# Altium schematic sheet [00] DACs.SchDoc
size A4
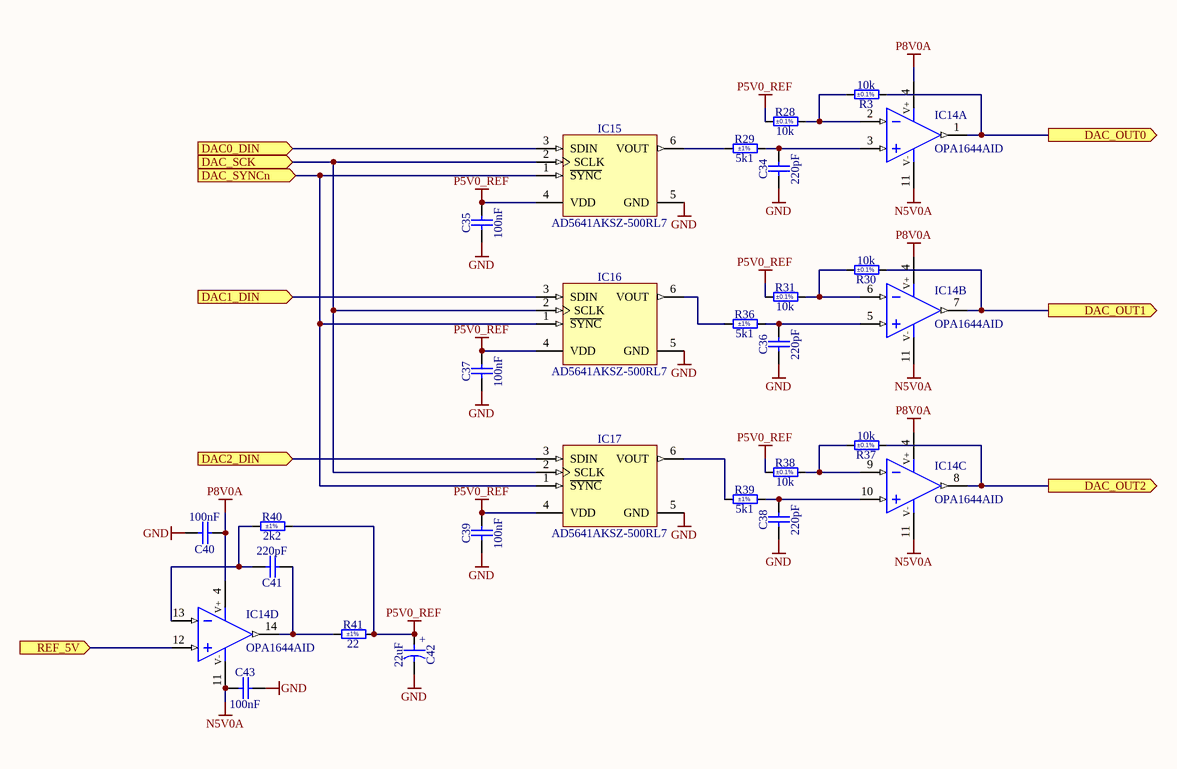
[diagram p0: [00] DACs.SchDoc]

## Parts
C34  220pF  [CAPC1608X87N]
C35  100nF  [CAPC1005X55N]
C36  220pF  [CAPC1608X87N]
C37  100nF  [CAPC1005X55N]
C38  220pF  [CAPC1608X87N]
C39  100nF  [CAPC1005X55N]
C40  100nF  [CAPC1005X55N]
C41  220pF  [CAPC1608X87N]
C42  22uF  [CAPMP3528X210N]
C43  100nF  [CAPC1005X55N]
IC14  OPA1644AID  [SOIC127P600X175-14N]  (parts A,B,C,D of 4)
IC15  AD5641AKSZ-500RL7  [SOT65P210X110-6N]
IC16  AD5641AKSZ-500RL7  [SOT65P210X110-6N]
IC17  AD5641AKSZ-500RL7  [SOT65P210X110-6N]
R3  10k  Tolerance: ±0.1%  [RESC1608X64N]
R28  10k  Tolerance: ±0.1%  [RESC1608X64N]
R29  5k1  Tolerance: ±1%  [RESC1608X55N]
R30  10k  Tolerance: ±0.1%  [RESC1608X64N]
R31  10k  Tolerance: ±0.1%  [RESC1608X64N]
R36  5k1  Tolerance: ±1%  [RESC1608X55N]
R37  10k  Tolerance: ±0.1%  [RESC1608X64N]
R38  10k  Tolerance: ±0.1%  [RESC1608X64N]
R39  5k1  Tolerance: ±1%  [RESC1608X55N]
R40  2k2  Tolerance: ±1%  [RESC1608X55N]
R41  22  Tolerance: ±1%  [RESC1005X40N]

## Ports
DAC0_DIN (in), DAC1_DIN (in), DAC2_DIN (in), DAC_OUT0 (out), DAC_OUT1 (out), DAC_OUT2 (out), DAC_SCK (in), DAC_SYNCn (in), REF_5V (in)

## Nets
GND: C34.1 C35.1 C36.1 C37.1 C38.1 C39.1 C40.1 C42.2 C43.1 IC15.5(GND) IC16.5(GND) IC17.5(GND)
N5V0A: C43.2 IC14.11(V-)
P5V0_REF: C35.2 C37.2 C39.2 C42.1 IC15.4(VDD) IC16.4(VDD) IC17.4(VDD) R28.1 R31.1 R38.1 R40.2 R41.2
P8V0A: C40.2 IC14.4(V+)
DAC0_DIN: IC15.3(SDIN) ; port DAC0_DIN
DAC1_DIN: IC16.3(SDIN) ; port DAC1_DIN
DAC2_DIN: IC17.3(SDIN) ; port DAC2_DIN
DAC_OUT0: IC14.1(OUT) R3.1 ; port DAC_OUT0
DAC_OUT1: IC14.7(OUT) R30.1 ; port DAC_OUT1
DAC_OUT2: IC14.8(OUT) R37.1 ; port DAC_OUT2
DAC_SCK: IC15.2(SCLK) IC16.2(SCLK) IC17.2(SCLK) ; port DAC_SCK
DAC_SYNCn: IC15.1(~{SYNC}) IC16.1(~{SYNC}) IC17.1(~{SYNC}) ; port DAC_SYNCn
REF_5V: IC14.12(IN+) ; port REF_5V
NetC34_2: C34.2 IC14.3(IN+) R29.2
NetC36_2: C36.2 IC14.5(IN+) R36.2
NetC38_2: C38.2 IC14.10(IN+) R39.2
NetC41_1: C41.1 IC14.14(OUT) R41.1
NetC41_2: C41.2 IC14.13(IN-) R40.1
NetIC14_2: IC14.2(IN-) R3.2 R28.2
NetIC14_6: IC14.6(IN-) R30.2 R31.2
NetIC14_9: IC14.9(IN-) R37.2 R38.2
NetIC15_6: IC15.6(VOUT) R29.1
NetIC16_6: IC16.6(VOUT) R36.1
NetIC17_6: IC17.6(VOUT) R39.1

## Notes on the sheet
- (in symbol CTE3528-21_22UF_20V_10%_LESR0400) +

## Library data of the parts
C34 C36 C38 C41 = CC0603_220PF_50V_5%_NP0: Non-polarised capacitor; Part Description: SMD Multilayer Chip Ceramic Capacitor; Manufacturer: GENERIC; Manufacturer1 Part Number: 223886715221; Voltage: 50V; TC: C0G/NP0; Tolerance: ±5%; Part Number: CC0603_220PF_50V_5%_NP0; Component Kind: Standard; Component Type: Standard; Pin Count: 2; Value: 220pF; Status: Preferred; Manufacturer Part Number: CC0603_220PF_50V_5%_NP0; Case: 0603; Mounted: Yes; Socket: No; SMD: Yes; Sense: No; Manufacturer1 Example: PHYCOMP; Manufacturer1 ComponentHeight: 0.87mm; HelpURL: \\cern.ch\dfs\Applications\Altium\Datasheets\CC0603_NP0_PHYCOMP.pdf; Author: CERN DEM JLC; CreateDate: 03.12.2007; LatestRevisionDate: 03.12.2007
C35 C37 C39 C40 C43 = CC0402_100NF_16V_10%_X7R: Non-polarised capacitor; Part Description: SMD Multilayer Chip Ceramic Capacitor; Manufacturer: GENERIC; Manufacturer1 Part Number: GRM155R71C104KA88D; Voltage: 16V; TC: X7R; Tolerance: ±10%; Part Number: CC0402_100NF_16V_10%_X7R; Component Kind: Standard; Component Type: Standard; Pin Count: 2; Value: 100nF; Status: Not Recommended; Manufacturer Part Number: CC0402_100NF_16V_10%_X7R; Case: 0402; Mounted: Yes; Socket: No; SMD: Yes; Sense: No; Manufacturer1 Example: MURATA; Manufacturer1 ComponentHeight: 0.55mm; HelpURL: \\cern.ch\dfs\Applications\Altium\Datasheets\CC0402_X7R_MURATA_GRM.pdf; Author: CERN DEM JLC; CreateDate: 05.12.2013; LatestRevisionDate: 03.12.2007
C42 = CTE3528-21_22UF_20V_10%_LESR0400: Polarised capacitor; Part Description: Low ESR 0R4 Solid Tantalum Chip Capacitor; Manufacturer: GENERIC; Manufacturer1 Part Number: TPSB226K020R0400; Voltage: 20V; Tolerance: ±10%; Part Number: CTE3528-21_22UF_20V_10%_LESR0400; Component Kind: Standard; Component Type: Standard; Pin Count: 2; Value: 22uF; Status: Preferred; Manufacturer Part Number: CTE3528-21_22UF_20V_10%_LESR0400; Case: B; Mounted: Yes; Socket: No; SMD: Yes; Sense: No; Manufacturer1 Example: AVX; Manufacturer1 ComponentHeight: 2.1mm; HelpURL: \\cern.ch\dfs\Applications\Altium\Datasheets\CTE-LESR_AVX_TPS.pdf; Author: CERN DEM JLC; CreateDate: 25.04.2013; LatestRevisionDate: 25.04.2013
IC14 = OPA1644AID: Quad Operational Amplifier; Part Description: Quad High-Performance, JFET-Input, Audio Operational Amplifier; Manufacturer: TEXAS INSTRUMENTS; PressFit: No; Bonding: No; Part Number: OPA1644AID; Component Kind: Standard; Component Type: Standard; Device: OPA1644AID; PackageDescription: SOIC 14, Pitch 1.27mm - Body 4x8.75mm, IPC Medium Density; Manufacturer Part Number: OPA1644AID; Pin Count: 14; Case: SOIC14; Mounted: Yes; Socket: No; SMD: Yes; Sense: No; ComponentHeight: 1.75mm; Author: CERN DEM JLC; HelpURL: \\cern.ch\dfs\Applications\Altium\Datasheets\OPA1644AID.pdf; CreateDate: 31.03.2011; LatestRevisionDate: 31.03.2011
IC15-IC17 = AD5641AKSZ-500RL7: 2.7V to 5.5V, <100µA, 14-Bit nanoDAC, SPI Interface; Manufacturer: ANALOG DEVICES; PressFit: No; Bonding: No; Part Number: AD5641AKSZ-500RL7; Component Kind: Standard; Component Type: Standard; Device: AD5641AKSZ-500RL7; PackageDescription: SOT363, SC70-6, 0.65mm Pitch; 6 pin, 1.25mm W X 2.00mm L X 1.10mm H body, IPC Medium Density; Part Description: 2.7V to 5.5V, <100μA, 14-Bit nanoDAC, SPI Interface; Manufacturer Part Number: AD5641AKS; Pin Count: 6; Case: SOT363; Mounted: Yes; Socket: No; SMD: Yes; Sense: No; ComponentHeight: 1.1mm; Author: CERN DEM JLC; HelpURL: \\cern.ch\dfs\Applications\Altium\Datasheets\AD5641AKSZ-500RL7.pdf; CreateDate: 23.10.2008; LatestRevisionDate: 24.03.2022
R3 R28 R30 R31 R37 R38 = R0603_10K_0.1%_0.1W_25PPM: Resistor - 0.1%; Part Description: Thin Film Chip Resistor; Manufacturer: GENERIC; Manufacturer1 Part Number: ERA3AEB103V; Power: 0.1W; TC: ±25ppm/°C; PressFit: No; Part Number: R0603_10K_0.1%_0.1W_25PPM; Component Kind: Standard; Component Type: Standard; Pin Count: 2; Value: 10k; Status: Not Recommended; Manufacturer Part Number: R0603_10K_0.1%_0.1W_25PPM; Case: 0603; Mounted: Yes; Sense: No; Socket: No; SMD: Yes; Manufacturer1 Example: PANASONIC; Manufacturer1 ComponentHeight: 0.55mm; HelpURL: \\cern.ch\dfs\Applications\Altium\Datasheets\R0603_PANASONIC_ERA.pdf; Author: CERN DEM JMW; CreateDate: 09.11.2015; LatestRevisionDate: 11.01.2017
R29 R36 R39 = R0603_5K1_1%_0.1W_100PPM: Resistor - 1%; Part Description: General Purpose Thick Film Chip Resistor; Manufacturer: GENERIC; Manufacturer1 Part Number: NRC06F5101TRF; Power: 0.1W; TC: ±100ppm/°C; PressFit: No; Part Number: R0603_5K1_1%_0.1W_100PPM; Component Kind: Standard; Component Type: Standard; Pin Count: 2; Value: 5k1; Status: Preferred; Manufacturer Part Number: R0603_5K1_1%_0.1W_100PPM; Case: 0603; Mounted: Yes; Sense: No; Socket: No; SMD: Yes; Manufacturer1 Example: NIC COMPONENT; Manufacturer1 ComponentHeight: 0.55mm; HelpURL: \\cern.ch\dfs\Applications\Altium\Datasheets\R0603_NIC_NRC.pdf; Author: CERN DEM JLC; CreateDate: 03.12.2007; LatestRevisionDate: 13.03.2008
R40 = R0603_2K2_1%_0.1W_100PPM: Resistor - 1%; Part Description: General Purpose Thick Film Chip Resistor; Manufacturer: GENERIC; Manufacturer1 Part Number: NRC06F2201TRF; Power: 0.1W; TC: ±100ppm/°C; PressFit: No; Part Number: R0603_2K2_1%_0.1W_100PPM; Component Kind: Standard; Component Type: Standard; Pin Count: 2; Value: 2k2; Status: Preferred; Manufacturer Part Number: R0603_2K2_1%_0.1W_100PPM; Case: 0603; Mounted: Yes; Sense: No; Socket: No; SMD: Yes; Manufacturer1 Example: NIC COMPONENT; Manufacturer1 ComponentHeight: 0.55mm; HelpURL: \\cern.ch\dfs\Applications\Altium\Datasheets\R0603_NIC_NRC.pdf; Author: CERN DEM JLC; CreateDate: 03.12.2007; LatestRevisionDate: 13.03.2008
R41 = R0402_22R_1%_0.0625W_100PPM: Resistor - 1%; Part Description: General Purpose Thick Film Chip Resistor; Manufacturer: GENERIC; Manufacturer1 Part Number: 232270672209L; TC: ±100ppm/°C; PressFit: No; Part Number: R0402_22R_1%_0.0625W_100PPM; Component Kind: Standard; Component Type: Standard; Pin Count: 2; Value: 22; Status: Not Recommended; Power: 0.0625W; Manufacturer Part Number: R0402_22R_1%_0.0625W_100PPM; Case: 0402; Mounted: Yes; Sense: No; Socket: No; SMD: Yes; Manufacturer1 Example: YAGEO PHYCOMP; Manufacturer1 ComponentHeight: 0.4mm; HelpURL: \\cern.ch\dfs\Applications\Altium\Datasheets\R0402_Phycomp_RC0402.pdf; Author: CERN DEM JLC; CreateDate: 03.12.2007; LatestRevisionDate: 17.10.2012